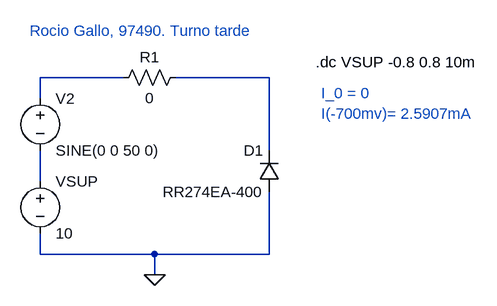
[diagram p0: schematic ejercicio-dispo-actividad-3.asc]
ejercicio-dispo-actividad-3.asc, the LTspice schematic file:
Version 4
SHEET 1 940 680
WIRE 384 128 256 128
WIRE 608 128 464 128
WIRE 256 160 256 128
WIRE 608 240 608 128
WIRE 256 288 256 240
WIRE 256 400 256 368
WIRE 432 400 256 400
WIRE 608 400 608 304
WIRE 608 400 432 400
WIRE 432 432 432 400
FLAG 432 432 0
SYMBOL diode 624 304 R180
WINDOW 0 24 64 Left 2
WINDOW 3 24 0 Left 2
SYMATTR InstName D1
SYMATTR Value RR274EA-400
SYMBOL voltage 256 272 R0
SYMATTR InstName VSUP
SYMATTR Value 10
SYMBOL voltage 256 144 R0
SYMATTR InstName V2
SYMATTR Value SINE(0 0 50 0)
SYMBOL res 480 112 R90
WINDOW 0 0 56 VBottom 2
WINDOW 3 32 56 VTop 2
SYMATTR InstName R1
SYMATTR Value 0
TEXT 680 104 Left 2 !.dc VSUP -0.8 0.8 10m
TEXT 240 56 Left 2 ;Rocio Gallo, 97490. Turno tarde
TEXT 688 152 Left 2 ;I_0 = 0\nI(-700mv)= 2.5907mA

The netlist it stands for:
* ejercicio-dispo-actividad-3.asc
D1 0 N002 RR274EA-400
VSUP N003 0 10
V2 N001 N003 SINE(0 0 50 0)
R1 N002 N001 0
.model D D
.lib standard.dio
.dc VSUP -0.8 0.8 10m
* Rocio Gallo, 97490. Turno tarde
* I_0 = 0
* I(-700mv)= 2.5907mA
.backanno
.end